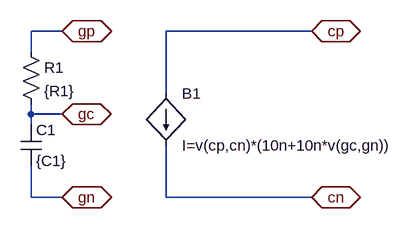
[diagram p0: schematic S_AIME.asc]
S_AIME.asc, the LTspice schematic file:
Version 4.1
SHEET 1 880 680
WIRE 224 16 176 16
WIRE 608 16 384 16
WIRE 176 48 176 16
WIRE 384 112 384 16
WIRE 176 144 176 128
WIRE 224 144 176 144
WIRE 176 160 176 144
WIRE 176 272 176 224
WIRE 224 272 176 272
WIRE 384 272 384 192
WIRE 608 272 384 272
FLAG 224 16 gp
IOPIN 224 16 BiDir
FLAG 224 272 gn
IOPIN 224 272 BiDir
FLAG 224 144 gc
IOPIN 224 144 BiDir
FLAG 608 16 cp
IOPIN 608 16 BiDir
FLAG 608 272 cn
IOPIN 608 272 BiDir
SYMBOL cap 160 160 R0
SYMATTR InstName C1
SYMATTR Value {C1}
SYMBOL res 160 32 R0
SYMATTR InstName R1
SYMATTR Value {R1}
SYMBOL bi 384 112 R0
SYMATTR InstName B1
SYMATTR Value I=v(cp,cn)*(10n+10n*v(gc,gn))

The netlist it stands for:
* S_AIME.asc
C1 gc gn {C1}
R1 gp gc {R1}
B1 cp cn I=v(cp,cn)*(10n+10n*v(gc,gn))
.backanno
.end